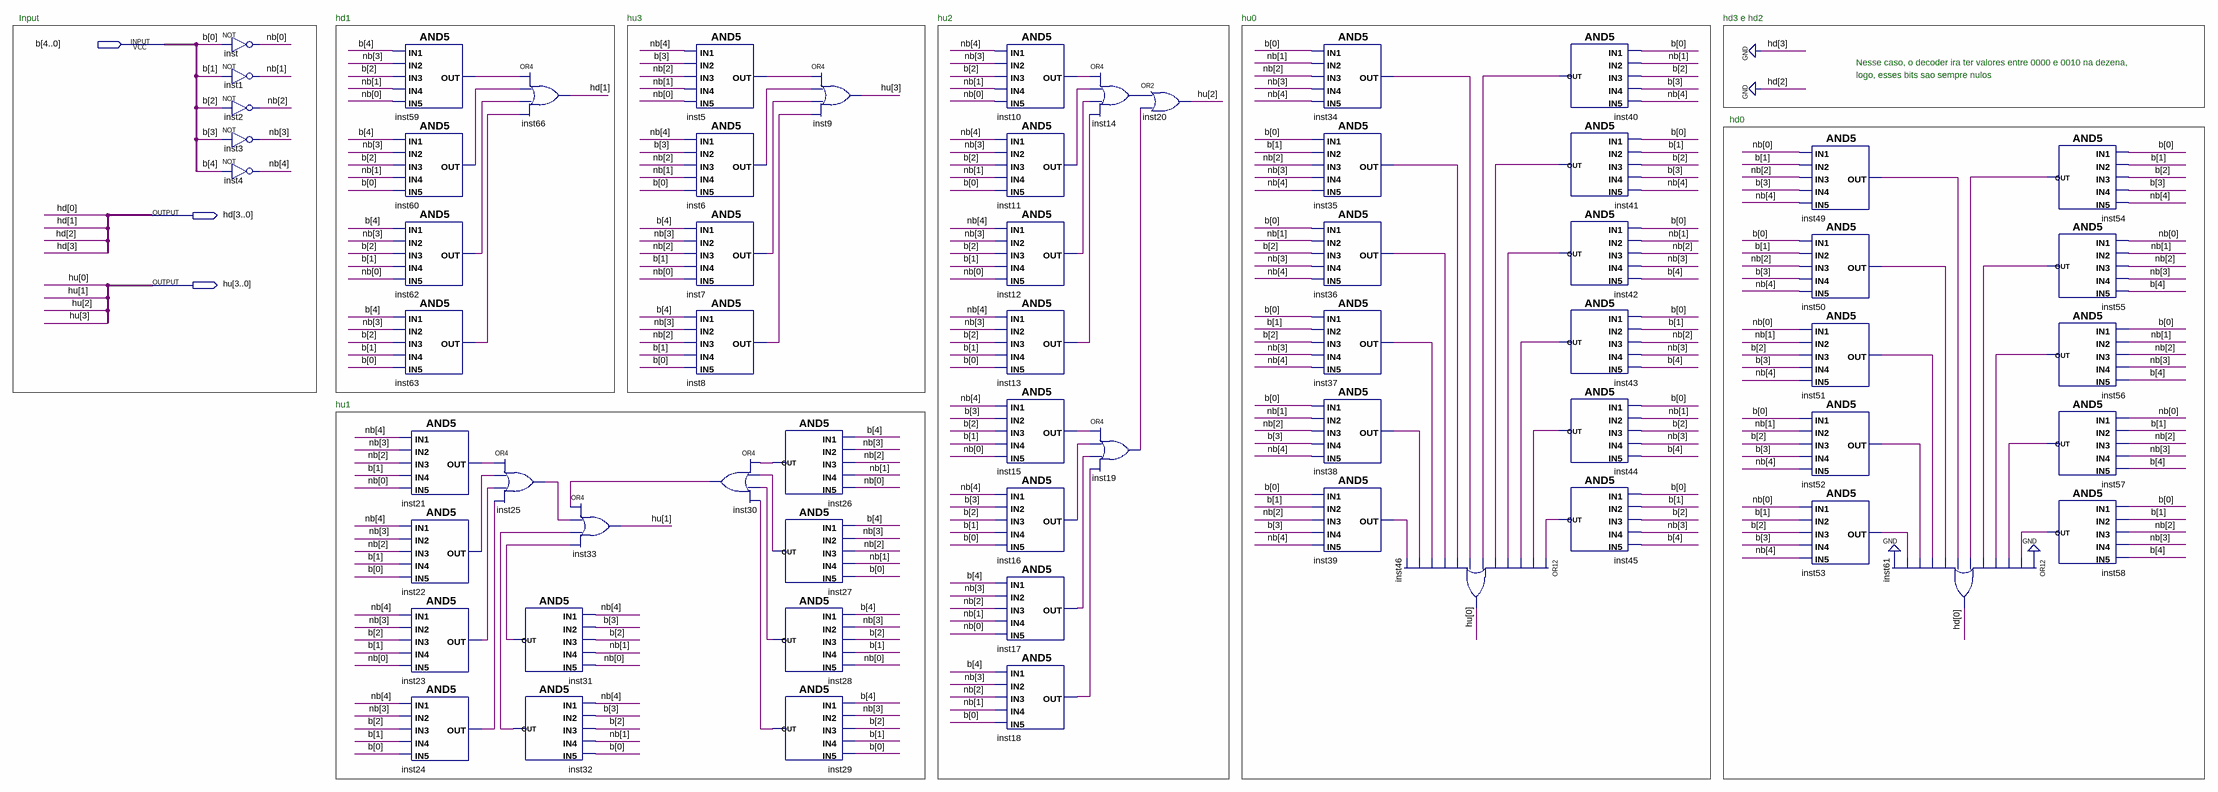
[diagram p0: schematic sheet]
// Quartus schematic bcd5_to_44.bdf as structural Verilog: 63 symbols, 3 pins
module bcd5_to_44 (
  input  [4:0] b,
  output [3:0] hd,
  output [3:0] hu
);

  wire inst5_out, inst6_out, inst7_out, inst8_out, inst10_out, inst11_out, inst12_out, inst13_out,
       inst14_out, inst15_out, inst16_out, inst17_out, inst18_out, inst19_out, inst21_out, inst22_out,
       inst23_out, inst24_out, inst25_out, inst26_out, inst27_out, inst28_out, inst29_out, inst30_out,
       inst31_out, inst32_out, inst34_out, inst35_out, inst36_out, inst37_out, inst38_out, inst39_out,
       inst40_out, inst41_out, inst42_out, inst43_out, inst44_out, inst45_out, inst49_out, inst50_out,
       inst51_out, inst52_out, inst53_out, inst54_out, inst55_out, inst56_out, inst57_out, inst58_out,
       inst59_out, inst60_out, inst62_out, inst63_out;
  wire [4:0] nb;

  not inst (nb[0], b[0]);
  not inst1 (nb[1], b[1]);
  not inst2 (nb[2], b[2]);
  not inst3 (nb[3], b[3]);
  not inst4 (nb[4], b[4]);
  and inst59 (inst59_out, b[4], nb[3], b[2], nb[1], nb[0]);
  and inst60 (inst60_out, b[4], nb[3], b[2], nb[1], b[0]);
  and inst62 (inst62_out, b[4], nb[3], b[2], b[1], nb[0]);
  and inst63 (inst63_out, b[4], nb[3], b[2], b[1], b[0]);
  and inst21 (inst21_out, nb[4], nb[3], nb[2], b[1], nb[0]);
  and inst22 (inst22_out, nb[4], nb[3], nb[2], b[1], b[0]);
  and inst23 (inst23_out, nb[4], nb[3], b[2], b[1], nb[0]);
  and inst24 (inst24_out, nb[4], nb[3], b[2], b[1], b[0]);
  or inst25 (inst25_out, inst21_out, inst22_out, inst23_out, inst24_out);
  or inst66 (hd[1], inst59_out, inst60_out, inst62_out, inst63_out);
  and inst31 (inst31_out, nb[4], b[3], b[2], nb[1], nb[0]);
  and inst32 (inst32_out, nb[4], b[3], b[2], nb[1], b[0]);
  or inst33 (hu[1], inst30_out, inst25_out, inst32_out, inst31_out);
  and inst5 (inst5_out, nb[4], b[3], nb[2], nb[1], nb[0]);
  and inst6 (inst6_out, nb[4], b[3], nb[2], nb[1], b[0]);
  and inst7 (inst7_out, b[4], nb[3], nb[2], b[1], nb[0]);
  and inst8 (inst8_out, b[4], nb[3], nb[2], b[1], b[0]);
  or inst30 (inst30_out, inst26_out, inst27_out, inst28_out, inst29_out);
  or inst9 (hu[3], inst5_out, inst6_out, inst7_out, inst8_out);
  and inst26 (inst26_out, b[4], nb[3], nb[2], nb[1], nb[0]);
  and inst27 (inst27_out, b[4], nb[3], nb[2], nb[1], b[0]);
  and inst28 (inst28_out, b[4], nb[3], b[2], b[1], nb[0]);
  and inst29 (inst29_out, b[4], nb[3], b[2], b[1], b[0]);
  and inst10 (inst10_out, nb[4], nb[3], b[2], nb[1], nb[0]);
  and inst11 (inst11_out, nb[4], nb[3], b[2], nb[1], b[0]);
  and inst12 (inst12_out, nb[4], nb[3], b[2], b[1], nb[0]);
  and inst13 (inst13_out, nb[4], nb[3], b[2], b[1], b[0]);
  and inst15 (inst15_out, nb[4], b[3], b[2], b[1], nb[0]);
  and inst16 (inst16_out, nb[4], b[3], b[2], b[1], b[0]);
  and inst17 (inst17_out, b[4], nb[3], nb[2], nb[1], nb[0]);
  and inst18 (inst18_out, b[4], nb[3], nb[2], nb[1], b[0]);
  or inst14 (inst14_out, inst10_out, inst11_out, inst12_out, inst13_out);
  or inst19 (inst19_out, inst15_out, inst16_out, inst17_out, inst18_out);
  or inst20 (hu[2], inst14_out, inst19_out);
  and inst34 (inst34_out, b[0], nb[1], nb[2], nb[3], nb[4]);
  and inst35 (inst35_out, b[0], b[1], nb[2], nb[3], nb[4]);
  and inst36 (inst36_out, b[0], nb[1], b[2], nb[3], nb[4]);
  and inst37 (inst37_out, b[0], b[1], b[2], nb[3], nb[4]);
  and inst38 (inst38_out, b[0], nb[1], nb[2], b[3], nb[4]);
  and inst39 (inst39_out, b[0], b[1], nb[2], b[3], nb[4]);
  or inst46 (hu[0], inst45_out, inst44_out, inst43_out, inst42_out, inst41_out, inst40_out, inst34_out, inst35_out, inst36_out, inst37_out, inst38_out, inst39_out);
  and inst40 (inst40_out, b[0], nb[1], b[2], b[3], nb[4]);
  and inst41 (inst41_out, b[0], b[1], b[2], b[3], nb[4]);
  and inst42 (inst42_out, b[0], nb[1], nb[2], nb[3], b[4]);
  and inst43 (inst43_out, b[0], b[1], nb[2], nb[3], b[4]);
  and inst44 (inst44_out, b[0], nb[1], b[2], nb[3], b[4]);
  and inst45 (inst45_out, b[0], b[1], b[2], nb[3], b[4]);
  and inst49 (inst49_out, nb[0], b[1], nb[2], b[3], nb[4]);
  and inst50 (inst50_out, b[0], b[1], nb[2], b[3], nb[4]);
  and inst51 (inst51_out, nb[0], nb[1], b[2], b[3], nb[4]);
  and inst52 (inst52_out, b[0], nb[1], b[2], b[3], nb[4]);
  and inst53 (inst53_out, nb[0], b[1], b[2], b[3], nb[4]);
  or inst61 (hd[0], 1'b0, inst58_out, inst57_out, inst56_out, inst55_out, inst54_out, inst49_out, inst50_out, inst51_out, inst52_out, inst53_out, 1'b0);
  and inst54 (inst54_out, b[0], b[1], b[2], b[3], nb[4]);
  and inst55 (inst55_out, nb[0], nb[1], nb[2], nb[3], b[4]);
  and inst56 (inst56_out, b[0], nb[1], nb[2], nb[3], b[4]);
  and inst57 (inst57_out, nb[0], b[1], nb[2], nb[3], b[4]);
  and inst58 (inst58_out, b[0], b[1], nb[2], nb[3], b[4]);

  assign hd[3:2] = 2'b00;

  // Notes on the sheet:
  //   Input
  //   hd1
  //   hu3
  //   hu2
  //   hu0
  //   hd3 e hd2
  //   Nesse caso, o decoder ira ter valores entre 0000 e 0010 na dezena,
  //   logo, esses bits sao sempre nulos
  //   hd0
  //   hu1
endmodule
